# EAGLE design ArduinoNanoShield (EAGLE 9.0.1)
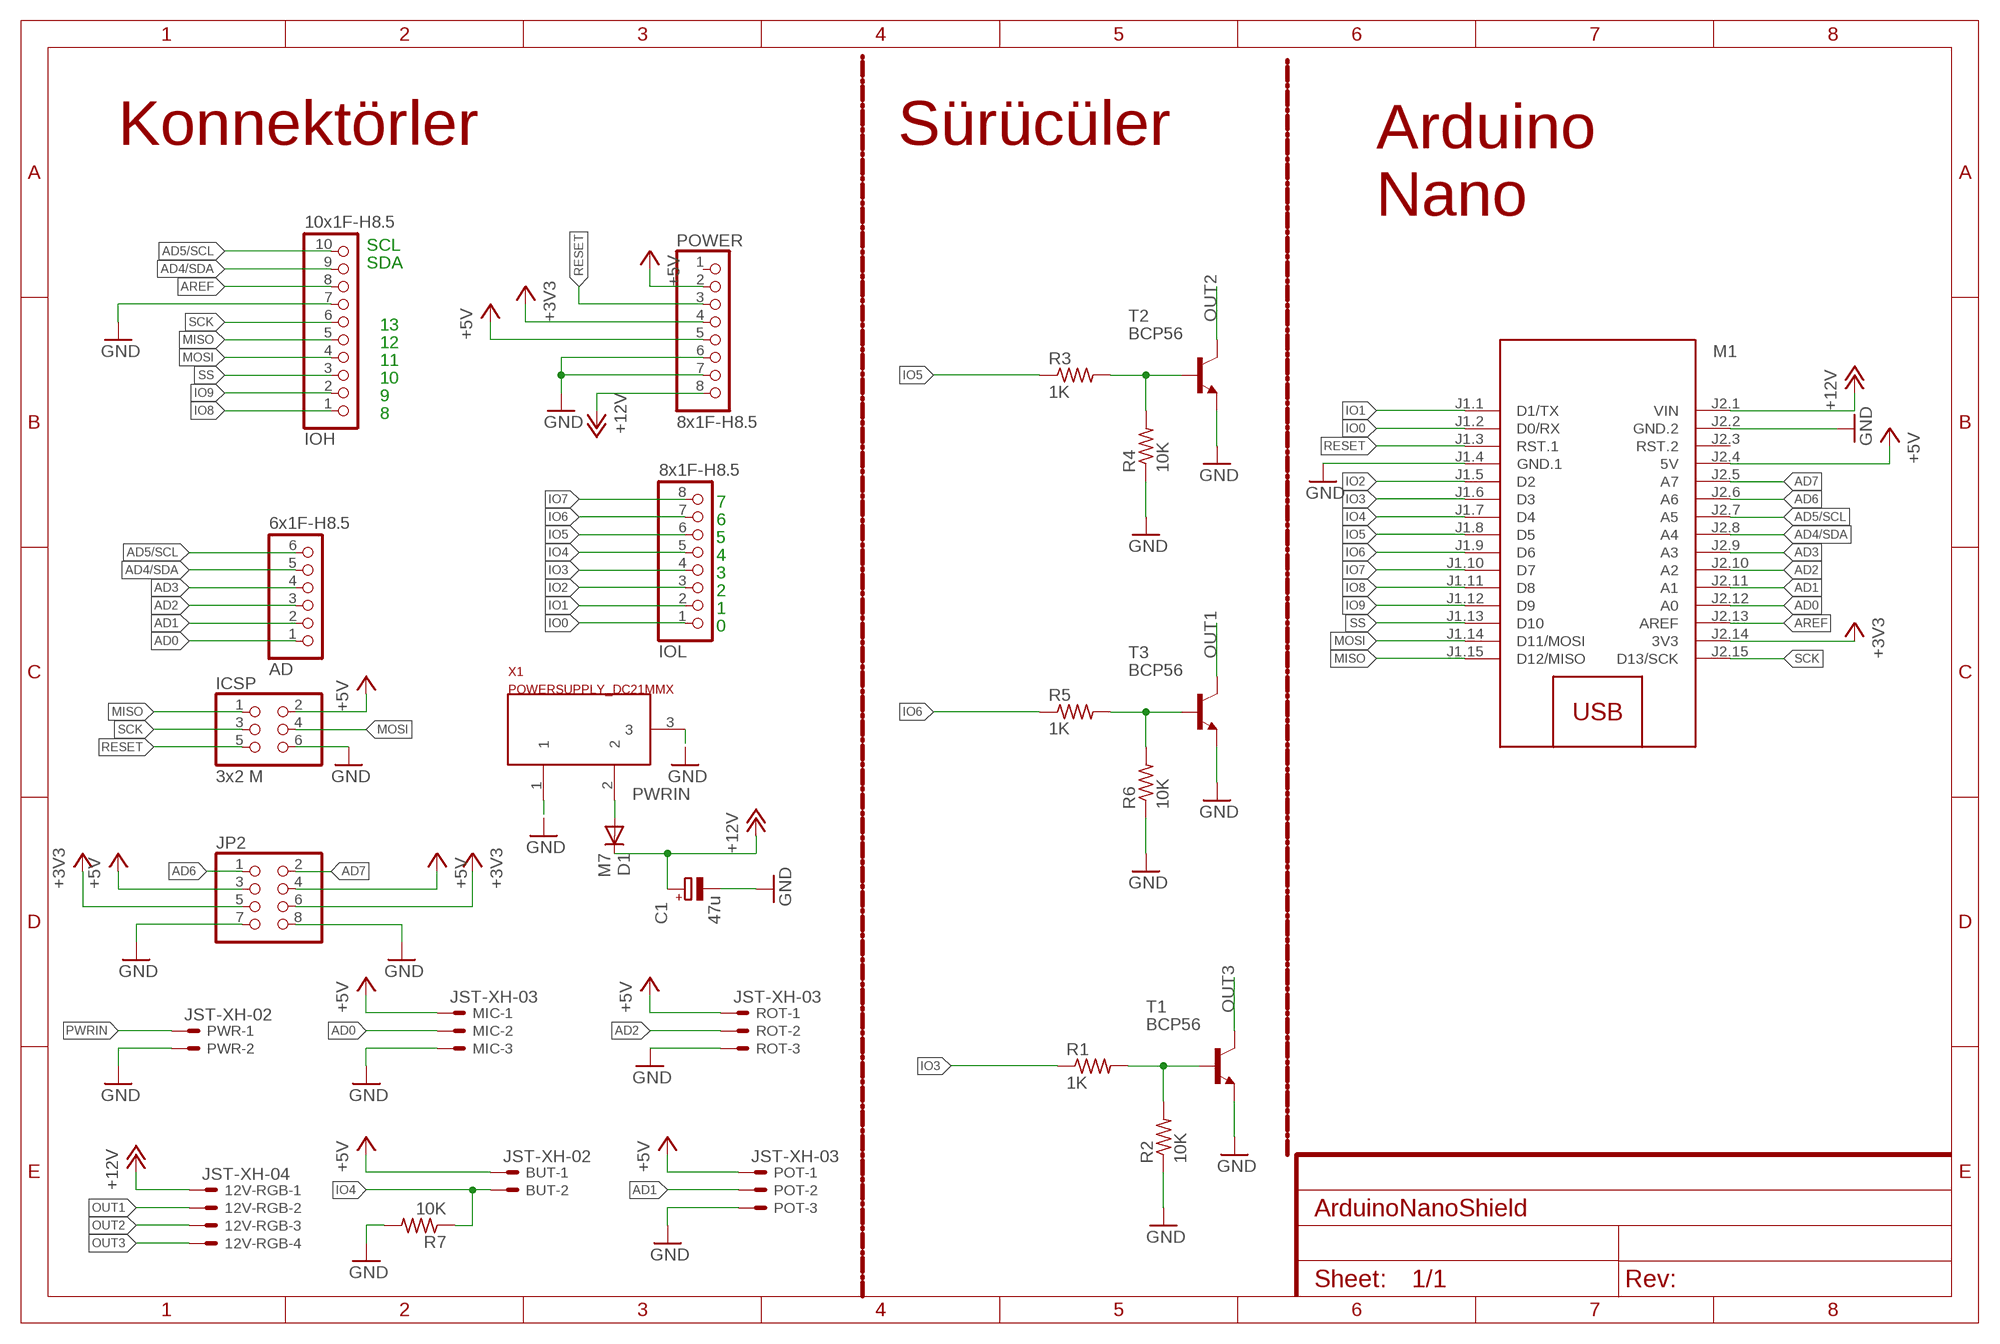
[diagram p0: schematic, sheet 1]

## Parts
12V-RGB  JST-XH-04  JST-XH-04-PIN-ROUND-PAD  [JST-XH-04-PACKAGE-ROUND-PAD]
AD  6x1F-H8.5  PINHD-1X6  [1X06]
BUT  JST-XH-02  JST-XH-02-PIN-ROUND-PAD  [JST-XH-02-PACKAGE-ROUND-PAD]
C1  47u  CPOL-EUD  [PANASONIC_D]
D1  M7  DIODE-SMB  [SMB]
ICSP  3x2 M  PINHD-2X3  [2X03]
IOH  10x1F-H8.5  PINHD-1X10_ARD  [1X10]
IOL  8x1F-H8.5  PINHD-1X8  [1X08]
JP2  PINHD-2X4  [2X04]
M1  ARDUINO-NANO  [ARDUINO-NANO]
MIC  JST-XH-03  JST-XH-03-PIN-ROUND-PAD  [JST-XH-03-PACKAGE-ROUND-PAD]
POT  JST-XH-03  JST-XH-03-PIN-ROUND-PAD  [JST-XH-03-PACKAGE-ROUND-PAD]
POWER  8x1F-H8.5  PINHD-1X8  [1X08]
PWR  JST-XH-02  JST-XH-02-PIN-ROUND-PAD  [JST-XH-02-PACKAGE-ROUND-PAD]
R1  1K  R-US_M0805  [M0805]
R2  10K  R-US_M0805  [M0805]
R3  1K  R-US_M0805  [M0805]
R4  10K  R-US_M0805  [M0805]
R5  1K  R-US_M0805  [M0805]
R6  10K  R-US_M0805  [M0805]
R7  10K  R-US_M0805  [M0805]
ROT  JST-XH-03  JST-XH-03-PIN-ROUND-PAD  [JST-XH-03-PACKAGE-ROUND-PAD]
T1  BCP56  PZT2222A-NPN-SOT223  [SOT223]
T2  BCP56  PZT2222A-NPN-SOT223  [SOT223]
T3  BCP56  PZT2222A-NPN-SOT223  [SOT223]
X1  POWERSUPPLY_DC21MMX  [POWERSUPPLY_DC-21MM]

## Nets
+3V3: JP2.5 JP2.6 M1.J2.14(3V3) POWER.4
+5V [usbvcc]: BUT.1 ICSP.2 JP2.3 JP2.4 M1.J2.4(5V) MIC.1 POT.1 POWER.2 POWER.5 ROT.1
+12V: 12V-RGB.1 C1.+ D1.C M1.J2.1(VIN) POWER.8
AD0: AD.1 M1.J2.12(A0) MIC.2
AD1: AD.2 M1.J2.11(A1) POT.2
AD2: AD.3 M1.J2.10(A2) ROT.2
AD3: AD.4 M1.J2.9(A3)
AD4/SDA: AD.5 IOH.9 M1.J2.8(A4)
AD5/SCL: AD.6 IOH.10 M1.J2.7(A5)
AD6: JP2.1 M1.J2.6(A6)
AD7: JP2.2 M1.J2.5(A7)
AREF [aref]: IOH.8 M1.J2.13(AREF)
GND [gnd]: C1.- ICSP.6 IOH.7 JP2.7 JP2.8 M1.J1.4(GND.1) M1.J2.2(GND.2) MIC.3 POT.3 POWER.6 POWER.7 PWR.2 R2.1 R4.1 R6.1 R7.2 ROT.3 T1.3(E) T2.3(E) T3.3(E) X1.1 X1.3
IO0: IOL.1 M1.J1.2(D0/RX)
IO1: IOL.2 M1.J1.1(D1/TX)
IO2: IOL.3 M1.J1.5(D2)
IO3: IOL.4 M1.J1.6(D3) R1.1
IO4: BUT.2 IOL.5 M1.J1.7(D4) R7.1
IO5: IOL.6 M1.J1.8(D5) R3.1
IO6: IOL.7 M1.J1.9(D6) R5.1
IO7: IOL.8 M1.J1.10(D7)
IO8: IOH.1 M1.J1.11(D8)
IO9: IOH.2 M1.J1.12(D9)
MISO: ICSP.1 IOH.5 M1.J1.15(D12/MISO)
MOSI: ICSP.4 IOH.4 M1.J1.14(D11/MOSI)
N$1: R1.2 R2.2 T1.1(B)
N$4: R3.2 R4.2 T2.1(B)
N$7: R5.2 R6.2 T3.1(B)
OUT1: 12V-RGB.2 T3.4(C)
OUT2: 12V-RGB.3 T2.4(C)
OUT3: 12V-RGB.4 T1.4(C)
PWRIN [power]: D1.A PWR.1 X1.2
RESET: ICSP.5 M1.J1.3(RST.1) POWER.3
SCK: ICSP.3 IOH.6 M1.J2.15(D13/SCK)
SS: IOH.3 M1.J1.13(D10)
Unconnected: M1.J2.3(RST.2) POWER.1

## Notes on the sheet
- Konnektörler | Sürücüler
- Arduino
  Nano
- SCL
- SDA
- 13
- 12
- 11
- 10
- 9
- 8
- 7
- 6
- 5
- 4
- 3
- 2
- 1
- 0

## Library data of the parts
12V-RGB = Rembrandt Electronics - JST XH Connectors v1-0:JST-XH-04-PIN: JST XH Connector 2 Pin Wire to board connector. Pitch: 2,54 mm, (0.100") Number of pins: 4 Created by Rembrandt Electronics www.rembrandtelectronics.com
AD = SmartPrj:PINHD-1X6: PIN HEADER
BUT PWR = Rembrandt Electronics - JST XH Connectors v1-0:JST-XH-02-PIN: JST XH Connector 2 Pin Wire to board connector. Pitch: 2,54 mm, (0.100") Number of pins: 2 Created by Rembrandt Electronics www.rembrandtelectronics.com
C1 = rcl:CPOL-EU: POLARIZED CAPACITOR, European symbol
D1 = diode:DIODE-: DIODE
ICSP = pinhead:PINHD-2X3: PIN HEADER
IOH = SmartPrj:PINHD-1X10_ARD: PIN HEADER
IOL POWER = SmartPrj:PINHD-1X8: PIN HEADER
JP2 = pinhead:PINHD-2X4: PIN HEADER
M1 = OmerFaruk-CPUBoards:ARDUINO-NANO: Arduino Nano 3.0
MIC POT ROT = Rembrandt Electronics - JST XH Connectors v1-0:JST-XH-03-PIN: JST XH Connector 2 Pin Wire to board connector. Pitch: 2,54 mm, (0.100") Number of pins: 3 Created by Rembrandt Electronics www.rembrandtelectronics.com
R1-R7 = adafruit:R-US_: RESISTOR, American symbol
T1-T3 = transistor-neu-to92:*-NPN-: NPN Transistror
X1 = SmartPrj:POWERSUPPLY_DC21MM

## Net classes
1 power: width 0.61 mm, drill 0.61 mm, clearance 0.254 mm
2 gnd: width 0.305 mm, drill 0.559 mm, clearance 0.254 mm
3 usbvcc: width 0.508 mm, drill 0.61 mm, clearance 0.254 mm
4 aref: width 0.406 mm, drill 0.61 mm, clearance 0.254 mm

## Board
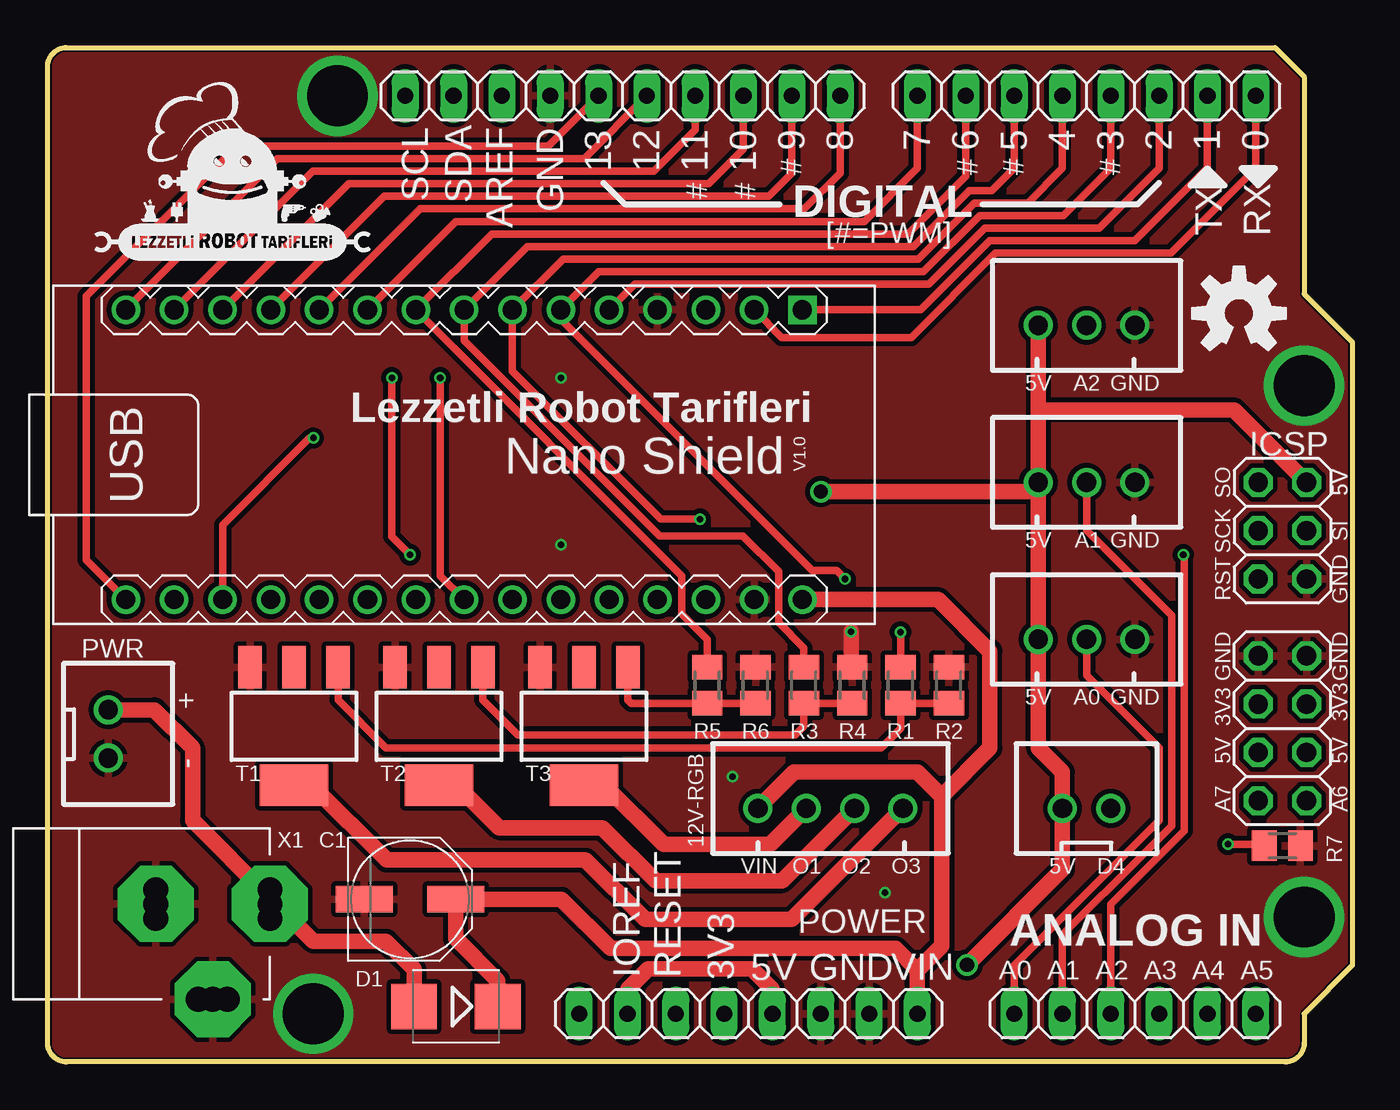
[diagram p1: board, top side]
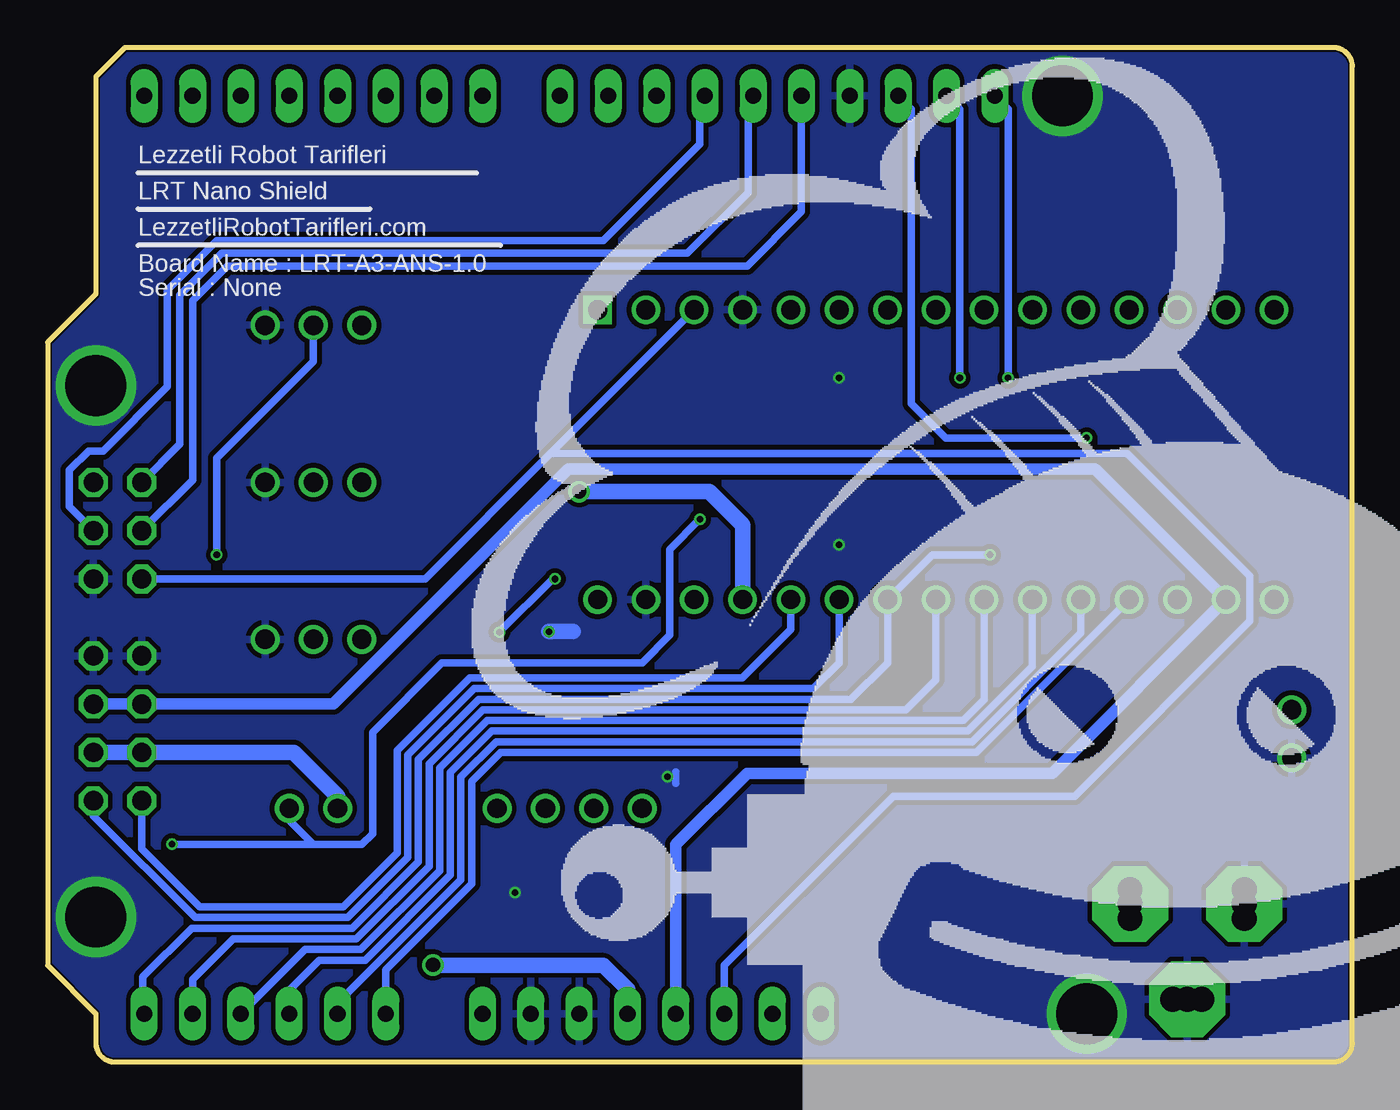
[diagram p2: board, bottom side, seen from below]

Size 68.58 x 53.34 mm. Coordinates in mm from the lower left corner, seen from the top.
Outline: 64.52,53.34 66.04,51.82 66.04,40.39 68.58,37.85 68.58,5.08 66.04,2.54 66.04,1 arc-90 65.04,0 1,0 arc-90 0,1 0,52.34 arc-90 1,53.34 64.52,53.34
Copper layers (1*16): Top 0.035mm / dielectric 1.5mm / Bottom 0.035mm
Design rules "PCBWAY *": minimum track width 6mil, minimum drill 6mil, track to track 6mil, track to pad 6mil, pad to pad 6mil, via to via 6mil, smd to smd 5mil, copper to edge 4mil, drill to drill 4mil, minimum pad ring 5mil, minimum via ring 5mil, stop-mask expansion 2mil, vias tented up to drill 6mil, thermal gap 10mil
vRestrict: area 129.9,42.6 to 131.6,47.6; area 132.4,44 to 134.1,47.6; area 135.4,43.8 to 136.6,47.3; area 138,43.8 to 139.1,47.3; area 140.5,43.8 to 141.7,47.3; area 143.1,43.8 to 144.2,47.3; area 145.7,45.7 to 146.9,47.3; area 147.3,43.6 to 154.6,45.4; area 167.3,42.7 to 168.7,45.2; area 169.9,42.7 to 171.3,45.2; area 168.3,34.3 to 171.8,35.7; area 107.6,20.3 to 109,28.6; area 112.7,21.1 to 114.4,28.6; area 154.9,8.8 to 155.5,9.3; area 157.4,8.7 to 157.9,9.5; area 118.3,27.3 to 119.7,29.6; area 151.8,46 to 153.1,47.4; area 154.6,45.9 to 155.8,47.4; area 157.2,45.9 to 158.3,47.4; area 159.8,45.9 to 161,47.4; area 162.2,45.9 to 163.4,47.4; area 164.9,45.9 to 166.1,47.4; area 167.5,45.9 to 168.6,47.4; area 170,45.9 to 171.1,47.4; area 148.3,45.7 to 149.4,47.3; area 107.3,10.9 to 116.4,23

### Footprints (pad centres in the part's own frame; a part is rotated, then mirrored left to right if it is on the bottom)
JST-XH-04-PACKAGE-ROUND-PAD = drill 1.016: 1 -3.81,0; 2 -1.27,0; 3 1.27,0; 4 3.81,0
1X06 = drill 0.85 pad 1.422 long: 1 -6.35,0; 2 -3.81,0; 3 -1.27,0; 4 1.27,0; 5 3.81,0; 6 6.35,0
JST-XH-02-PACKAGE-ROUND-PAD = drill 1.016: 1 -1.27,0; 2 1.27,0
PANASONIC_D = smd 3 x 1.4: + 2.4,0; - -2.4,0
SMB = smd 2.4 x 2.4: A 2.2,0; C -2.2,0
2X03 = drill 1.016 octagon: 1 -2.54,-1.27; 2 -2.54,1.27; 3 0,-1.27; 4 0,1.27; 5 2.54,-1.27; 6 2.54,1.27
1X10 = drill 0.85 pad 1.422 long: 1 -11.43,0; 2 -8.89,0; 3 -6.35,0; 4 -3.81,0; 5 -1.27,0; 6 1.27,0; 7 3.81,0; 8 6.35,0; 9 8.89,0; 10 11.43,0
1X08 = drill 0.85 pad 1.422 long: 1 -8.89,0; 2 -6.35,0; 3 -3.81,0; 4 -1.27,0; 5 1.27,0; 6 3.81,0; 7 6.35,0; 8 8.89,0
2X04 = drill 1.016 octagon: 1 -3.81,-1.27; 2 -3.81,1.27; 3 -1.27,-1.27; 4 -1.27,1.27; 5 1.27,-1.27; 6 1.27,1.27; 7 3.81,-1.27; 8 3.81,1.27
ARDUINO-NANO = drill 1 square: J1.1 17.78,7.62 | drill 1: J1.2 15.24,7.62; J1.3 12.7,7.62; J1.4 10.16,7.62; J1.5 7.62,7.62; J1.6 5.08,7.62; J1.7 2.54,7.62; J1.8 0,7.62; J1.9 -2.54,7.62; J1.10 -5.08,7.62; J1.11 -7.62,7.62; J1.12 -10.16,7.62; J1.13 -12.7,7.62; J1.14 -15.24,7.62; J1.15 -17.78,7.62; J2.1 17.78,-7.62; J2.2 15.24,-7.62; J2.3 12.7,-7.62; J2.4 10.16,-7.62; J2.5 7.62,-7.62; J2.6 5.08,-7.62; J2.7 2.54,-7.62; J2.8 0,-7.62; J2.9 -2.54,-7.62; J2.10 -5.08,-7.62; J2.11 -7.62,-7.62; J2.12 -10.16,-7.62; J2.13 -12.7,-7.62; J2.14 -15.24,-7.62; J2.15 -17.78,-7.62
JST-XH-03-PACKAGE-ROUND-PAD = drill 1.016: 1 -2.54,0; 2 0,0; 3 2.54,0
M0805 = smd 1.3 x 1.6: 1 -0.95,0; 2 0.95,0
SOT223 = smd 1.219 x 2.235: 1 -2.311,-3.099; 2 0,-3.099; 3 2.311,-3.099 | smd 3.6 x 2.2: 4 0,3.099
POWERSUPPLY_DC-21MM = drill 1.3 pad 4 octagon: 1 -5.08,-3.353; 2 -0.076,-6.35; 3 -0.076,-0.356 | drill 1.3: 4 -5.08,-4.115; 5 -5.08,-2.591; 6 -0.838,-0.356; 7 0.686,-0.356; 8 -0.838,-6.35; 9 0.686,-6.35

### Placement (x,y rotation side)
12V-RGB  41.15,13.34 0 top
AD  57.15,2.54 0 top
BUT  54.61,13.34 0 top
C1  19.05,8.56 0 top
D1  21.46,2.92 180 top
ICSP  64.9,27.94 270 top
IOH  30.23,50.8 180 top
IOL  54.61,50.8 180 top
JP2  64.9,17.55 90 top
M1  21.89,31.93 0 top
MIC  54.61,22.23 0 top
POT  54.61,30.48 0 top
POWER  36.83,2.54 0 top
PWR  3.19,17.25 270 top
R1  44.83,19.81 270 top
R2  47.37,19.81 270 top
R3  39.75,19.81 270 top
R4  42.29,19.81 270 top
R5  34.67,19.81 270 top
R6  37.21,19.81 270 top
R7  64.9,11.37 0 top
ROT  54.61,38.73 0 top
T1  12.95,17.65 180 top
T2  20.57,17.65 180 top
T3  28.19,17.65 180 top
U$1  [LRT-LOGO-0,0125-B]  9.59,41.62 0 top
U$2  [OSHW-LOGO-M]  62.61,39.37 0 top
U$4  [LRT-LOGO-0,10416-B-N_I]  11.75,-28.17 0 bottom  (outside the outline)
X1  5.33,8.38 90 top

### Tracks (layer width: path | path; a pad name or v marks a point on that pad's centre or on a via)
+3V3
  Bottom 0.61: POWER.4 35.56,11.43 31.81,15.18 15.79,15.18 M1.J2.14 13.53,31.18 41.21,31.18 53.57,18.82 JP2.6 JP2.5
+5V  (via drill 0.75)
  Top 0.61: 51.75,30.16 POT.1
  Top 0.813: POWER.5 38.1,3.81 37.01,4.9 31.57,4.9 30.48,3.81 POWER.2 | ROT.1 52.07,34.29 | 52.07,34.29 POT.1 | POT.1 MIC.1 52.07,16.51 53.34,15.24 BUT.1 53.34,10.12 v48.33,5.1 | ICSP.2 62.36,34.29 52.07,34.29 | v40.64,29.99 51.58,29.99 POT.1
  Bottom 0.813: POWER.5 38.1,3.81 39.37,5.08 48.3,5.08 v48.33,5.1 | BUT.1 53.34,13.97 55.65,16.28 JP2.4 JP2.3 | M1.J2.4 32.06,28.25 33.8,29.99 v40.64,29.99
+12V
  Top 0.813: D1.C 23.66,4.28 21.45,6.49 C1.+ 27,8.56 29.59,5.97 44.58,5.97 45.72,4.83 | POWER.8 45.72,4.83 | 12V-RGB.1 39.24,15.24 45.72,15.24 46.99,13.97 | 45.72,4.83 46.99,6.1 46.99,13.97 | 46.99,13.97 49.53,16.51 49.53,21.59 46.81,24.31 M1.J2.1
AD0
  Top 0.406: AD.1 50.8,5.08 58.42,12.7 58.42,16.51 54.61,20.32 MIC.2
  Bottom 0.406: M1.J2.12 19.76,16.28 44.77,16.28 46.29,14.76 46.29,9.36 50.8,4.85 AD.1
AD1
  Top 0.406: POT.2 54.61,27.94 59.08,23.47 59.08,12.43 57.66,11.01 53.34,6.69 AD.2
  Bottom 0.406: M1.J2.11 14.28,22.56 19.99,16.84 45,16.84 46.85,14.99 46.85,9.59 49.3,7.14 49.31,7.14 53.34,3.11 AD.2
AD2  (via drill 0.35)
  Top 0.406: AD.3 55.88,8.29 59.74,12.15 59.74,26.62 v59.69,26.67
  Bottom 0.406: v59.69,26.67 59.69,31.75 54.61,36.83 ROT.2 | AD.3 55.88,3.77 54.3,5.36 51.88,5.36 47.41,9.83 47.41,15.22 45.23,17.4 20.23,17.4 16.81,20.81 M1.J2.10
AD3
  Bottom 0.406: AD.4 55.04,5.92 53.66,5.92 52.11,5.92 47.97,10.06 47.97,15.45 45.46,17.96 20.46,17.96 19.36,19.06 M1.J2.9
AD4/SDA  (via drill 0.35)
  Top 0.406: M1.J2.8 20.64,25.57 v20.64,35.98
  Bottom 0.406: AD.5 60.96,4.34 58.83,6.48 52.34,6.48 48.53,10.29 48.53,15.68 45.7,18.52 23.48,18.52 21.91,20.09 21.91,24.29 M1.J2.8 | IOH.9 20.64,50.1 v20.64,35.98
AD5/SCL  (via drill 0.35)
  Top 0.406: v19.05,26.67 18.1,27.62 v18.1,35.98
  Bottom 0.406: IOH.10 18.1,50.1 v18.1,35.98 | v19.05,26.67 22.07,26.67 M1.J2.7 24.44,20.99 26.36,19.07 45.93,19.07 49.09,15.91 49.09,10.52 52.58,7.03 61,7.03 63.57,4.47 63.57,2.66 63.5,2.59 AD.6
AD6
  Bottom 0.406: M1.J2.6 26.97,20.99 28.34,19.63 46.16,19.63 49.65,16.14 49.65,10.75 52.81,7.59 60.81,7.59 66.17,12.95 JP2.1
AD7
  Bottom 0.406: JP2.2 63.63,11.2 60.58,8.15 53.04,8.15 50.21,10.99 50.21,16.38 46.39,20.19 32.07,20.19 29.52,22.75 M1.J2.5
AREF  (via drill 0.35)
  Top 0.406: M1.J2.13 9.19,28.25 13.76,32.81 v13.97,32.81
  Bottom 0.406: IOH.8 23.18,50.1 23.18,34.61 21.38,32.81 v13.97,32.81
GND  (via drill 0.35, 3.2)
  Top 0.406: R4.1 41.91,21.14
  Top 0.813: R4.1 42.23,20.82 v42.23,22.63
  Bottom 0.406: 35.56,14.66 35.56,15.24
  Bottom 0.813: v42.23,22.63 40.96,22.63
  other vias: 44.01,8.91 26.99,27.2 36.01,15.01 26.99,35.98 13.97,2.54 66.04,7.62 66.04,35.56 15.24,50.8
  pour Bottom: -2.54,-2.54 -2.54,55.88 71.12,55.88 71.12,-2.54
  pour Top: -5.08,-5.08 -5.08,58.42 73.66,58.42 73.66,-5.08
IO0
  Top 0.406: IOL.1 63.5,46.99 59.03,42.52 49.8,42.52 45.38,38.1 38.58,38.1 M1.J1.2
IO1
  Top 0.406: IOL.2 60.96,46.99 57.15,43.18 49.53,43.18 45.9,39.55 M1.J1.1
IO2
  Top 0.406: IOL.3 58.42,46.99 55.29,43.86 55.27,43.84 49.26,43.84 46.31,40.89 30.86,40.89 M1.J1.5
IO3  (via drill 0.35)
  Top 0.406: IOL.4 55.88,46.99 53.39,44.5 48.98,44.5 46.04,41.55 28.98,41.55 M1.J1.6 26.97,39.06 40.19,25.84 41.47,25.84 v41.91,25.4 | R1.1 v44.83,22.61
  Bottom 0.406: v44.83,22.61 42.04,25.4 v41.91,25.4
IO4  (via drill 0.35)
  Top 0.406: IOL.5 53.34,46.99 51.51,45.16 48.71,45.16 45.76,42.22 27.1,42.22 M1.J1.7 24.44,36.34 32.23,28.54 v34.29,28.54 | v62.04,11.45 63.73,11.45 R7.1
  Bottom 0.406: BUT.2 55.88,12.7 54.61,11.43 | 54.61,11.43 52.07,11.43 51.5,12 51.5,17.33 47.85,20.98 37.34,20.98 35.88,22.44 35.88,26.95 v34.29,28.54 | v62.04,11.45 62.02,11.43 54.61,11.43
IO5
  Top 0.406: IOL.6 50.8,46.99 49.63,45.82 48.44,45.82 45.49,42.88 25.22,42.88 M1.J1.8 21.89,37.94 32.18,27.65 36.54,27.65 38.42,25.78 38.42,23.11 39.75,21.78 R3.1
IO6
  Top 0.406: IOL.7 48.26,46.58 45.22,43.54 23.34,43.54 M1.J1.9 33.34,25.57 33.34,23.56 34.67,22.23 R5.1
IO7
  Top 0.406: M1.J1.10 21.46,44.2 42.93,44.2 45.72,46.99 IOL.8
IO8
  Top 0.406: IOH.1 41.66,46.74 39.78,44.86 19.58,44.86 M1.J1.11
IO9
  Top 0.406: IOH.2 39.12,46.74 37.9,45.52 17.7,45.52 M1.J1.12
MISO
  Top 0.406: M1.J1.15 12.06,47.5 28.19,47.5 IOH.5
  Bottom 0.406: IOH.5 31.75,50.55 31.75,45.72 34.95,42.52 59.42,42.52 61.62,40.32 61.62,32.49 ICSP.1
MOSI
  Top 0.406: IOH.4 34.04,49.02 31.85,46.84 13.94,46.84 M1.J1.14
  Bottom 0.406: ICSP.4 67.44,29.21 67.44,31.12 66.42,32.13 65.66,32.13 62.28,35.51 62.28,40.59 59.69,43.18 39.37,43.18 34.29,48.26 34.29,50.55 IOH.4
N$1
  Top 0.406: R2.2 R1.2 44.83,17.53 43.81,16.51 17.78,16.51 15.27,19.02 T1.1
N$4
  Top 0.406: R4.2 R3.2 39.75,17.65 39.31,17.21 24.7,17.21 22.86,19.05 22.86,20.73 T2.1
N$7
  Top 0.406: R6.2 R5.2 30.67,18.86 30.5,19.02 T3.1
OUT1
  Top 0.813: 12V-RGB.2 37.97,11.43 32.39,11.43 29.26,14.55 T3.4
OUT2
  Top 0.813: T2.4 21.51,14.55 23.75,12.32 29.16,12.32 31.95,9.53 38.61,9.53 12V-RGB.3
OUT3
  Top 0.813: T1.4 13.89,14.55 17.82,10.62 28.27,10.62 31.4,7.49 39.12,7.49 12V-RGB.4
PWRIN
  Top 0.813: PWR.1 5.61,18.52 7.62,16.51 7.62,12.7 11.68,8.64 X1.2 12.01,8.31 13.97,6.35 17.78,6.35 19.26,4.87 D1.A
RESET
  Bottom 0.406: M1.J1.3 42.15,31.99 | 42.15,31.99 48.74,25.4 ICSP.5 | POWER.3 33.02,5.08 24.13,13.97 14.61,13.97 5.4,23.18 5.4,25.54 11.85,31.99 42.15,31.99
SCK
  Top 0.406: 28.96,50.55 IOH.6 26.31,48.16 9.93,48.16 2.03,40.26 2.03,26.39 M1.J2.15
  Bottom 0.406: IOH.6 28.96,44.7 31.8,41.86 59.14,41.86 60.96,40.04 60.96,30.61 ICSP.3
SS
  Top 0.406: IOH.3 36.58,48.01 34.75,46.18 15.82,46.18 M1.J1.13

### Text on the board
tPlace: 13 | 12 | 11 | 10 | 9 | 8 | 7 | 6 | 5 | 4 | 3 | 2 | 1 | 0
bPlace: Lezzetli Robot Tarifleri | LRT Nano Shield | LezzetliRobotTarifleri.com | Board Name : LRT-A3-ANS-1.0 | Serial : None
tNames: SCL | SDA | AREF | GND | # | # | # | # | # | # | DIGITAL | [#=PWM] | TX | RX | 5V | A2 | GND | Lezzetli Robot Tarifleri | Nano Shield | V1.0 | SO | 5V | 5V | 5V | A1 | GND | SCK | SI | RST | GND | GND | GND | 5V | A0 | GND | + | 3V3 | 3V3 | R5 | R6 | R3 | R4 | R1 | R2 | 5V | 5V | - | T1 | T2 | T3 | A7 | A6 | X1 | C1 | R7 | VIN | O1 | O2 | O3 | 5V | D4 | ANALOG IN | D1 | IOREF | RESET | 3V3 | 5V | GND | VIN | A0 | A1 | A2 | A3 | A4 | A5
ReferenceLC: L | TX | ON | RX | PC1 | PC2
214bmp: D:/SmartProjects/Snc/a4_bn_logo2.bmp